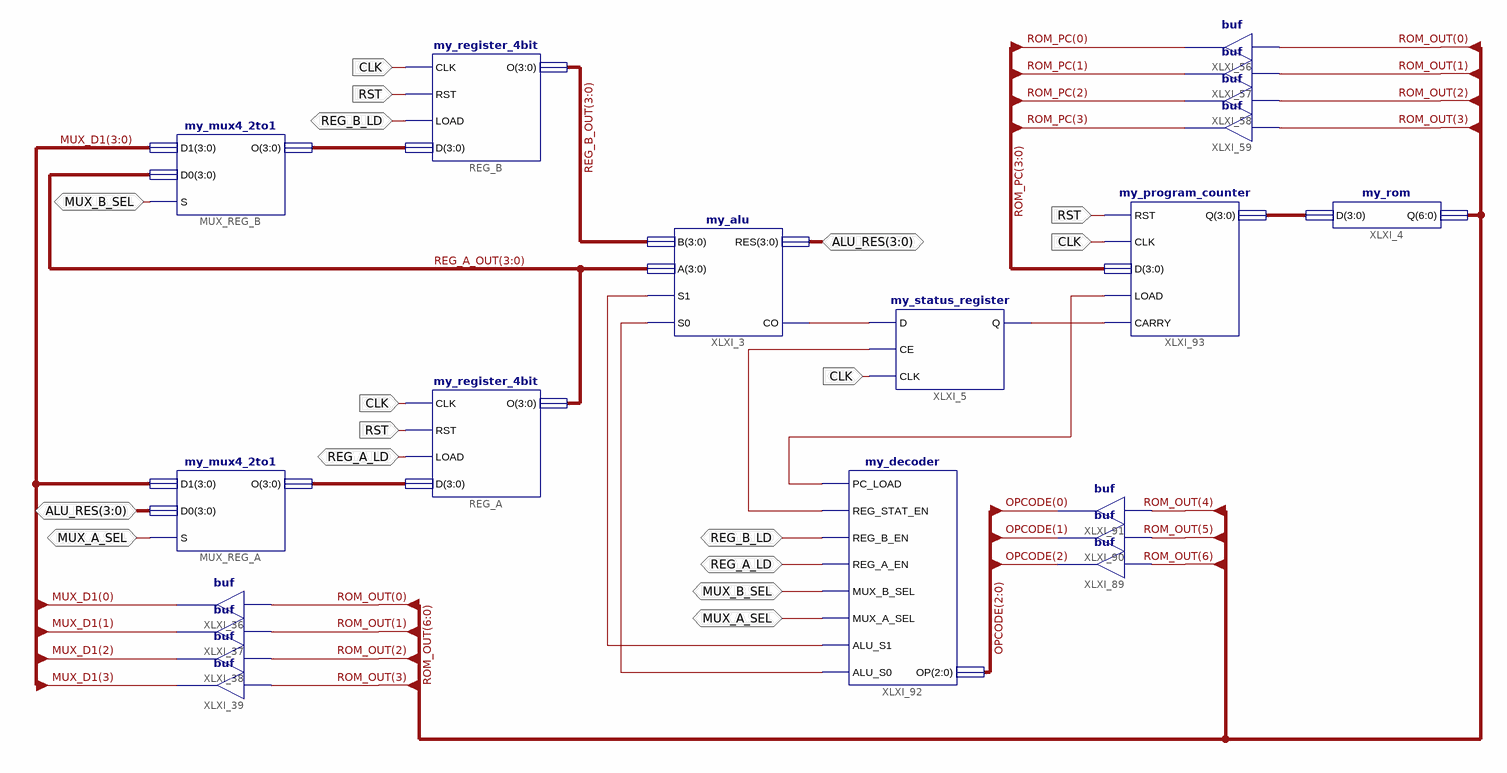
[diagram p0: schematic sheet 1]
// Xilinx ISE schematic my_cpu.sch (virtex6) as structural Verilog: 20 symbols, 7 ports
module my_cpu (
  input  CLK,
  input  RST,
  inout  MUX_B_SEL,
  inout  MUX_A_SEL,
  inout  REG_A_LD,
  inout  REG_B_LD,
  inout  [3:0] ALU_RES
);

  wire S0, S1, XLXN_5, XLXN_10, XLXN_371, XLXN_372;
  wire [2:0] OPCODE;
  wire [3:0] MUX_D1, MUXREGAO, MUXREGBO, PCO, REG_A_OUT, REG_B_OUT, ROM_PC;
  wire [6:0] ROM_OUT;

  my_alu XLXI_3 (.B(REG_B_OUT), .A(REG_A_OUT), .S1(S1), .S0(S0), .RES(ALU_RES), .CO(XLXN_5));
  my_mux4_2to1 MUX_REG_B (.D0(REG_A_OUT), .D1(MUX_D1), .S(MUX_B_SEL), .O(MUXREGBO));
  my_status_register XLXI_5 (.D(XLXN_5), .CE(XLXN_372), .CLK(CLK), .Q(XLXN_10));
  buf XLXI_59 (ROM_PC[3], ROM_OUT[3]);
  buf XLXI_58 (ROM_PC[2], ROM_OUT[2]);
  buf XLXI_57 (ROM_PC[1], ROM_OUT[1]);
  buf XLXI_56 (ROM_PC[0], ROM_OUT[0]);
  my_rom XLXI_4 (.D(PCO), .Q(ROM_OUT));
  my_mux4_2to1 MUX_REG_A (.D0(ALU_RES), .D1(MUX_D1), .S(MUX_A_SEL), .O(MUXREGAO));
  my_register_4bit REG_A (.CLK(CLK), .RST(RST), .LOAD(REG_A_LD), .D(MUXREGAO), .O(REG_A_OUT));
  my_register_4bit REG_B (.CLK(CLK), .RST(RST), .LOAD(REG_B_LD), .D(MUXREGBO), .O(REG_B_OUT));
  buf XLXI_39 (MUX_D1[3], ROM_OUT[3]);
  buf XLXI_38 (MUX_D1[2], ROM_OUT[2]);
  buf XLXI_37 (MUX_D1[1], ROM_OUT[1]);
  buf XLXI_36 (MUX_D1[0], ROM_OUT[0]);
  buf XLXI_89 (OPCODE[2], ROM_OUT[6]);
  buf XLXI_90 (OPCODE[1], ROM_OUT[5]);
  buf XLXI_91 (OPCODE[0], ROM_OUT[4]);
  my_decoder XLXI_92 (
    .ALU_S0(S0), .ALU_S1(S1), .MUX_A_SEL(MUX_A_SEL), .MUX_B_SEL(MUX_B_SEL), .OP(OPCODE), .PC_LOAD(XLXN_371),
    .REG_A_EN(REG_A_LD), .REG_B_EN(REG_B_LD), .REG_STAT_EN(XLXN_372));
  my_program_counter XLXI_93 (.RST(RST), .CLK(CLK), .D(ROM_PC), .LOAD(XLXN_371), .CARRY(XLXN_10), .Q(PCO));

  // Notes on the sheet:
  //   LOC on signal REG_A_OUT(3:0) = 
endmodule
